# Altium schematic sheet MKE1xFxxxVLH.SchDoc
size A; DocumentNumber: 2; SheetNumber: 2; SheetTotal: 12
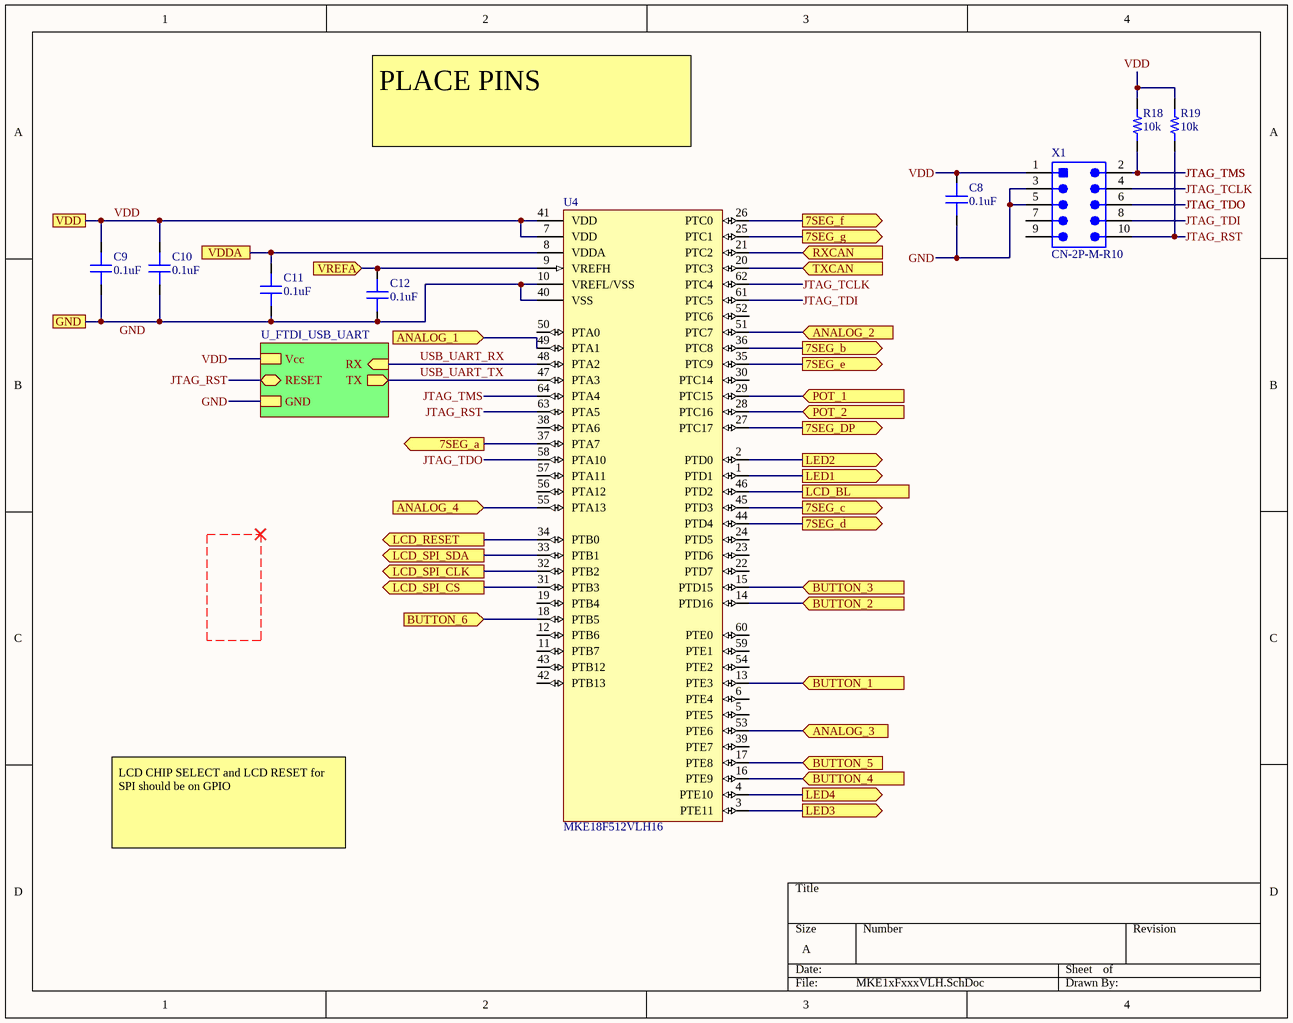
[diagram p0: MKE1xFxxxVLH.SchDoc]

## Parts
C8  capacitance: 0.1uF  [0603]  (hidden comment: capacitor)
C9  capacitance: 0.1uF  [0603]  (hidden comment: capacitor)
C10  capacitance: 0.1uF  [0603]  (hidden comment: capacitor)
C11  capacitance: 0.1uF  [0603]  (hidden comment: capacitor)
C12  capacitance: 0.1uF  [0603]  (hidden comment: capacitor)
R18  10k  [RES 0603/1608]
R19  10k  [RES 0603/1608]
U4  MKE18F512VLH16  [TQFP64]
X1  CN-2P-M-R10  [HDR2X5_SMT]

## Sub-sheets
U_FTDI_USB_UART = FTDI_USB_UART.SchDoc: Vcc, GND, RESET (bidir), TX (out), RX (in)

## Ports
7SEG_a (out), 7SEG_b (out), 7SEG_c (out), 7SEG_d (out), 7SEG_DP (out), 7SEG_e (out), 7SEG_f (out), 7SEG_g (out), ANALOG_1 (in), ANALOG_2 (in), ANALOG_3 (in), ANALOG_4 (in), BUTTON_1 (in), BUTTON_2 (in), BUTTON_3 (in), BUTTON_4 (in), BUTTON_5 (in), BUTTON_6 (in), GND, LCD_BL, LCD_RESET (out), LCD_SPI_CLK (out), LCD_SPI_CS (out), LCD_SPI_SDA (out), LED1 (out), LED2 (out), LED3 (out), LED4 (out), POT_1 (in), POT_2 (in), RXCAN (in), TXCAN (in), VDD, VDDA, VREFA (in)

## Nets
7SEG_a: U4.37(PTA7) ; port 7SEG_a
7SEG_b: U4.36(PTC8) ; port 7SEG_b
7SEG_c: U4.45(PTD3) ; port 7SEG_c
7SEG_d: U4.44(PTD4) ; port 7SEG_d
7SEG_DP: U4.27(PTC17) ; port 7SEG_DP
7SEG_e: U4.35(PTC9) ; port 7SEG_e
7SEG_f: U4.26(PTC0) ; port 7SEG_f
7SEG_g: U4.25(PTC1) ; port 7SEG_g
ANALOG_1: U4.49(PTA1) ; port ANALOG_1
ANALOG_2: U4.51(PTC7) ; port ANALOG_2
ANALOG_3: U4.53(PTE6) ; port ANALOG_3
ANALOG_4: U4.55(PTA13) ; port ANALOG_4
BUTTON_1: U4.13(PTE3) ; port BUTTON_1
BUTTON_2: U4.14(PTD16) ; port BUTTON_2
BUTTON_3: U4.15(PTD15) ; port BUTTON_3
BUTTON_4: U4.16(PTE9) ; port BUTTON_4
BUTTON_5: U4.17(PTE8) ; port BUTTON_5
BUTTON_6: U4.18(PTB5) ; port BUTTON_6
GND: C8.1 C9.1 C10.1 C11.1 C12.1 U4.10(VREFL/VSS) U4.40(VSS) X1.3 X1.5 ; port GND, sheet U_FTDI_USB_UART/GND
JTAG_RST: R19.1 U4.63(PTA5) X1.10 ; sheet U_FTDI_USB_UART/RESET
JTAG_TCLK: U4.62(PTC4) X1.4
JTAG_TDI: U4.61(PTC5) X1.8
JTAG_TDO: U4.58(PTA10) X1.6
JTAG_TMS: R18.1 U4.64(PTA4) X1.2
LCD_BL: U4.46(PTD2) ; port LCD_BL
LCD_RESET: U4.34(PTB0) ; port LCD_RESET
LCD_SPI_CLK: U4.32(PTB2) ; port LCD_SPI_CLK
LCD_SPI_CS: U4.31(PTB3) ; port LCD_SPI_CS
LCD_SPI_SDA: U4.33(PTB1) ; port LCD_SPI_SDA
LED1: U4.1(PTD1) ; port LED1
LED2: U4.2(PTD0) ; port LED2
LED3: U4.3(PTE11) ; port LED3
LED4: U4.4(PTE10) ; port LED4
POT_1: U4.29(PTC15) ; port POT_1
POT_2: U4.28(PTC16) ; port POT_2
RXCAN: U4.21(PTC2) ; port RXCAN
TXCAN: U4.20(PTC3) ; port TXCAN
USB_UART_RX: U4.48(PTA2) ; sheet U_FTDI_USB_UART/RX
USB_UART_TX: U4.47(PTA3) ; sheet U_FTDI_USB_UART/TX
VDD: C8.2 C9.2 C10.2 R18.2 R19.2 U4.7(VDD) U4.41(VDD) X1.1 ; port VDD, sheet U_FTDI_USB_UART/Vcc
VDDA: C11.2 U4.8(VDDA) ; port VDDA
VREFA: C12.2 U4.9(VREFH) ; port VREFA

Not connected (* = marked no-connect by the designer): U4 5(PTE5) 6(PTE4) 11(PTB7) 12(PTB6) 19(PTB4) 22(PTD7) 23(PTD6) 24(PTD5) 30(PTC14) 38(PTA6) 39(PTE7) 42(PTB13) 43(PTB12) 50(PTA0) 52(PTC6) 54(PTE2) 56(PTA12) 57(PTA11) 59(PTE1) 60(PTE0); X1 7 9

## Notes on the sheet
- PLACE PINS
- LCD CHIP SELECT and LCD RESET for SPI should be on GPIO

## Library data of the parts
C8-C12 = 1: Generic 0603 capacitor; id: 1; voltage: 50; dielectric: Ceramic; percent tolerance: 10; Name: 0603 Capacitor; ESR: 1; package: 0603; quantity: 0
R18 R19 = 1: id: 1; name: 0603 Resistor; percent tolerance: 5; resistance: 10k; package: 0603; quantity: 0
U4 = 1: 32b NXP Microcontroller; id: 1; voltagemin: 2.70000004768372; voltagemax: 5.5; name: MKE18F512VLH16; package: TQFP64; quantity: 0
X1 = 4: CONN_TE_2X5POS; id: 4; Name: 5103309-1; numcontacts: 10; numrows: 2; pitch: 2.54mm; MfrPartNo: *; link: https://www.digikey.com/product-detail/en/5103309-1/A33160-ND/1114898?utm_campaign=buynow&WT.z_cid=ref_octopart_dkc_buynow&utm_medium=aggregator&curr=usd&site=us&utm_source=octopart; quantity: 0